# EAGLE design ss_emg (EAGLE 7.6.0)
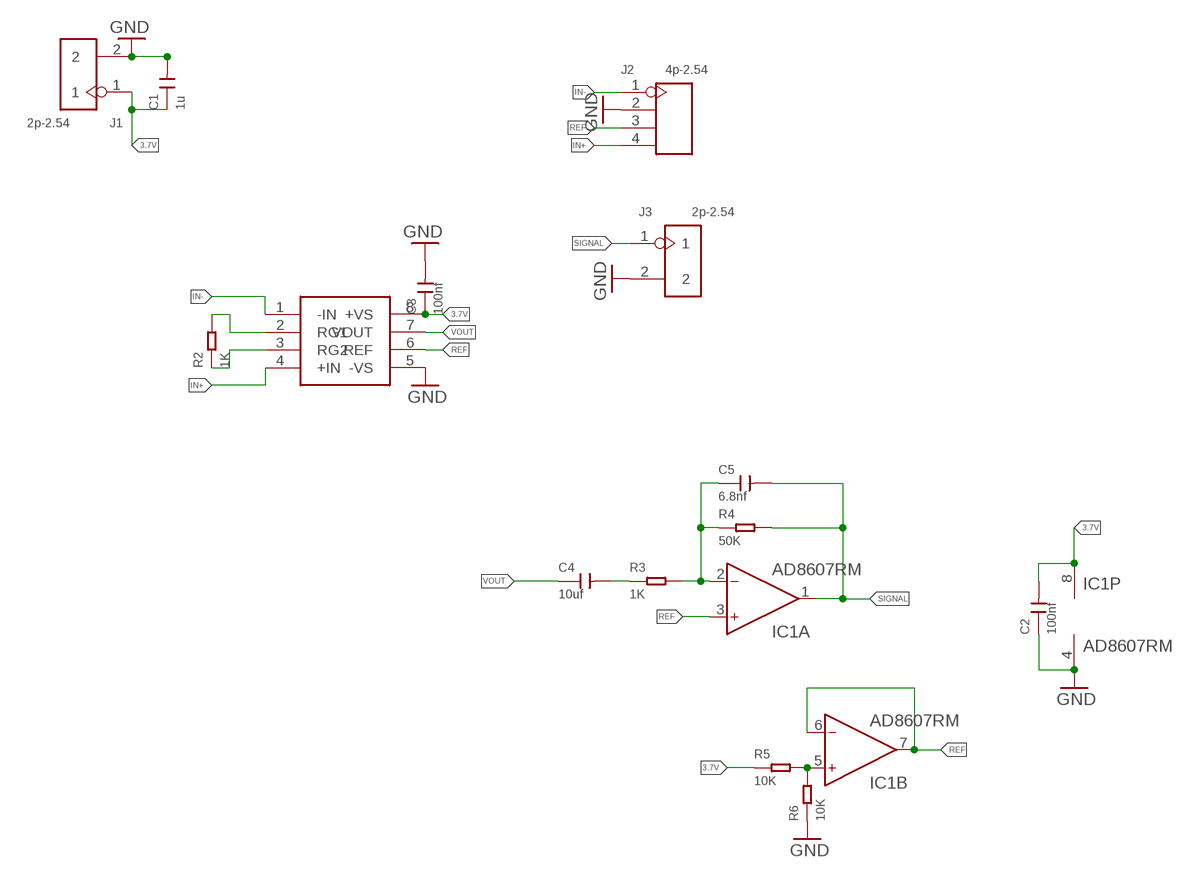
[diagram p0: schematic, sheet 1]

## Parts
C1  1u  CERAMIC-1.8PF-50V-0.1PF-NPO(0402)  [C0402]
C2  100nf  CERAMIC-1.8PF-50V-0.1PF-NPO(0402)  [C0402]
C3  100nf  CERAMIC-1.8PF-50V-0.1PF-NPO(0402)  [C0402]
C4  10uf  CERAMIC-1.8PF-50V-0.1PF-NPO(0402)  [C0402]
C5  6.8nf  CERAMIC-1.8PF-50V-0.1PF-NPO(0402)  [C0402]
IC1  AD8607RM  [MSOP08]
J1  2p-2.54  DIP-BLACK-FEMALE-HEADER-VERT(2P-2.54)  [H2-2.54]
J2  4p-2.54  DIP-BLACK-FEMALE-HEADER-VERT(4P-2.54)  [H4-2.54]
J3  2p-2.54  DIP-BLACK-FEMALE-HEADER-VERT(2P-2.54)  [H2-2.54]
R2  1K  SMD-RES-1K-5%-1/16W(0402)  [R0402]
R3  1K  SMD-RES-1K-5%-1/16W(0402)  [R0402]
R4  50K  SMD-RES-1K-5%-1/16W(0402)  [R0402]
R5  10K  SMD-RES-1K-5%-1/16W(0402)  [R0402]
R6  10K  SMD-RES-1K-5%-1/16W(0402)  [R0402]
U$1  AD8221  [MSOP08]

## Nets
3.7V: C1.1 C2.2 C3.1 IC1.8(P:V+) J1.1 R5.1 U$1.8(+VS)
GND: C1.2 C2.1 C3.2 IC1.4(P:V-) J1.2 J2.2 J3.2 R6.1 U$1.5(-VS)
IN+: J2.4 U$1.4(+IN)
IN-: J2.1 U$1.1(-IN)
N$1: R2.2 U$1.2(RG1)
N$2: R2.1 U$1.3(RG2)
N$3: C4.2 R3.1
N$4: C5.1 IC1.2(A:IN-) R3.2 R4.1
N$6: IC1.5(B:IN+) R5.2 R6.2
REF: IC1.3(A:IN+) IC1.6(B:IN-) IC1.7(B:OUT) J2.3 U$1.6(REF)
SIGNAL: C5.2 IC1.1(A:OUT) J3.1 R4.2
VOUT: C4.1 U$1.7(VOUT)

## Library data of the parts
C1-C5 = Seeed-OPL-Capacitor:CERAMIC-1.8PF-50V-0.1PF-NPO(0402): 302010046; MPN: GRM1555C1H1R8BA01D; VALUE: 1.8PF
IC1 = analog-devices:AD8607: Precision Micropower, Low Noise CMOS, Rail-to-Rail Input/Output Operational Amplifiers Source: http://www.analog.com/static/imported-files/data_sheets/AD8603_8607_8609.pdf; MF: ALTERA CORPORATION; MPN: AD8607ARMZ-REEL; OC_FARNELL: 1464990; OC_NEWARK: 59K6925
J1 J3 = Seeed-OPL-Connector:DIP-BLACK-FEMALE-HEADER-VERT(2P-2.54): 320030023; MPN: F185-1102A1BSYA1
J2 = Seeed-OPL-Connector:DIP-BLACK-FEMALE-HEADER-VERT(4P-2.54): 320030017; MPN: F185-1104A1BSYA1
R2 R3 = Seeed-OPL-Resistor:SMD-RES-1K-5%-1/16W(0402): 301010006; MPN: RC0402JR-071KL
R4-R6 = Seeed-OPL-Resistor:SMD-RES-1K-5%-1/16W(0402): 301010006; MPN: RC0402JR-071KL; VALUE: 1K
U$1 = 1-SelfUse:AD8221

## Board
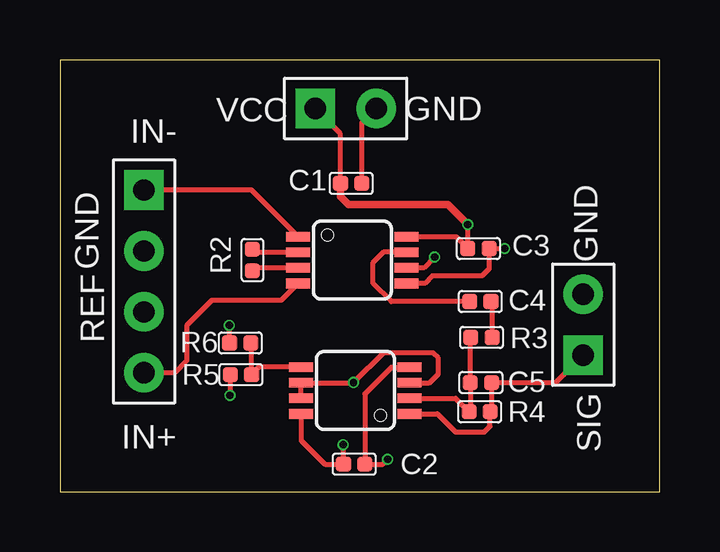
[diagram p1: board, top side]
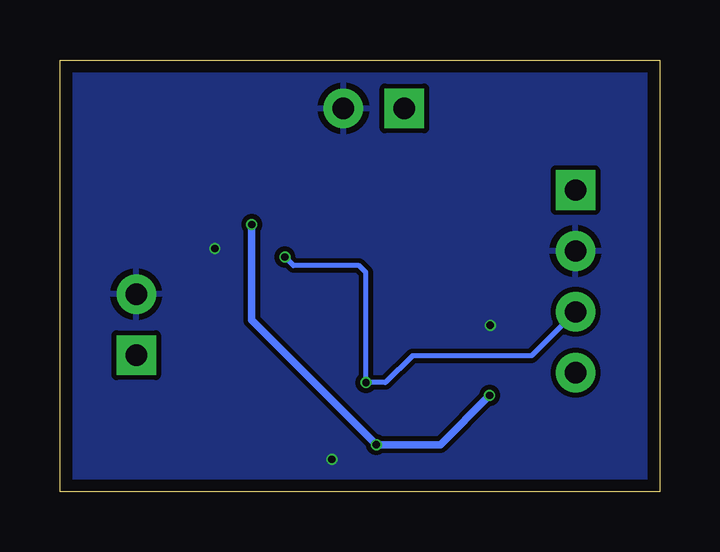
[diagram p2: board, bottom side, seen from below]

Size 25 x 18 mm. Coordinates in mm from the lower left corner, seen from the top.
Outline: 0,0 25,0 25,18 0,18 0,0
Copper layers (1*16): Top 0.035mm / dielectric 1.5mm / Bottom 0.035mm
Design rules "default *": minimum track width 8mil, minimum drill 12mil, track to track 8mil, track to pad 8mil, pad to pad 8mil, via to via 8mil, smd to smd 8mil, copper to edge 20mil, drill to drill 8mil, minimum pad ring 2mil, minimum via ring 2mil, stop-mask expansion 2mil, vias tented up to drill 12mil, thermal gap 10mil

### Footprints (pad centres in the part's own frame; a part is rotated, then mirrored left to right if it is on the bottom)
C0402 = smd 0.635 x 0.635: 1 0,0.445; 2 0,-0.445
MSOP08 = smd 0.4 x 1: 1 -0.976,-2.263; 2 -0.326,-2.263; 3 0.324,-2.263; 4 0.974,-2.263; 5 0.974,2.262; 6 0.324,2.262; 7 -0.326,2.262; 8 -0.976,2.262
H2-2.54 = drill 0.889 pad 1.651 square: 1 0,1.27 | drill 0.889 pad 1.651: 2 0,-1.27
H4-2.54 = drill 0.889 pad 1.651 square: 1 0,3.81 | drill 0.889 pad 1.651: 2 0,1.27; 3 0,-1.27; 4 0,-3.81
R0402 = smd 0.635 x 0.635: 1 0,0.445; 2 0,-0.445

### Placement (x,y rotation side)
C1  12.14,12.85 90 top
C2  12.27,1.14 270 top
C3  17.45,10.13 90 top
C4  17.53,7.92 90 top
C5  17.55,4.55 90 top
IC1  12.32,4.22 90 top
J1  11.91,15.98 90 top
J2  3.51,8.76 0 top
J3  21.82,6.96 180 top
R2  8.03,9.65 180 top
R3  17.58,6.43 270 top
R4  17.5,3.33 90 top
R5  7.54,4.88 90 top
R6  7.52,6.2 90 top
U$1  12.19,9.65 270 top

### Tracks (layer width: path | path; a pad name or v marks a point on that pad's centre or on a via)
3.7V  (via drill 0.3 pad 0.41)
  Top 0.203: v17,11.14 16.99,11.15 16.99,10.15 C3.1 16.51,10.63 U$1.8 | v11.81,1.96 11.82,1.94 C2.2 11.05,1.14 10.06,2.13 IC1.8 | C1.1 11.7,14.92 J1.1 | R5.1 7.1,4.03 v7.09,4.01
  Top 0.305: C1.1 11.7,12.31 12.04,11.96 16.18,11.96 16.99,11.15
  Bottom 0.305: v17,11.14 17,7.15 v11.81,1.96 9.14,1.96 v7.09,4.01
GND  (via drill 0.3 pad 0.41)
  Top 0.203: C1.2 12.59,15.38 J1.2 | v18.54,10.13 C3.2 17.89,9.28 17.6,8.99 15.52,8.99 15.21,8.69 14.46,8.69 U$1.5 | IC1.4 13.82,5.18 12.71,4.08 C2.1 13.46,1.14 v13.66,1.35 | R6.1 7.07,6.92 v7.06,6.93
  pour Bottom: -2.36,20.4 26.06,20.4 26.06,-2.44 -2.36,-2.44
IN+
  Top 0.203: U$1.4 9.23,7.98 6.33,7.98 5.28,6.93 5.28,5.46 4.78,4.95 J2.4
IN-
  Top 0.203: U$1.1 7.98,12.57 J2.1
N$1
  Top 0.203: U$1.2 8.14,9.98 R2.2
N$2
  Top 0.203: U$1.3 8.15,9.33 R2.1
N$3
  Top 0.203: R3.1 18.02,7.87 C4.2
N$4
  Top 0.203: IC1.2 16.49,3.89 R4.1 17.11,3.38 C5.1 17.11,6.4 R3.2
N$6
  Top 0.203: IC1.5 8.3,5.19 R5.2 7.96,4.9 R6.2
REF  (via drill 0.3 pad 0.41)
  Top 0.203: IC1.7 IC1.6 v12.24,4.54 v12.24,4.55 13.49,5.79 15.54,5.79 15.77,5.56 15.77,4.9 15.41,4.54 IC1.3 | v15.62,9.78 15.17,9.33 U$1.6
  Bottom 0.203: v15.62,9.78 15.27,9.42 12.52,9.42 12.24,9.14 v12.24,4.55 11.43,4.55 10.31,5.66 5.33,5.66 J2.3
SIGNAL
  Top 0.203: IC1.1 15.73,3.24 16.48,2.49 17.7,2.49 17.93,2.72 17.93,3.31 R4.2 18,3.38 C5.2 20.68,4.55 J3.1
VOUT
  Top 0.203: C4.1 13.82,7.92 13.06,8.69 13.06,9.55 13.51,10.01 14.42,10.01 U$1.7

### Text on the board
tPlace: IN- | GND | VCC | GND | GND | REF | IN+ | SIG